# EAGLE schematic esp01 (EAGLE 7.2.0)
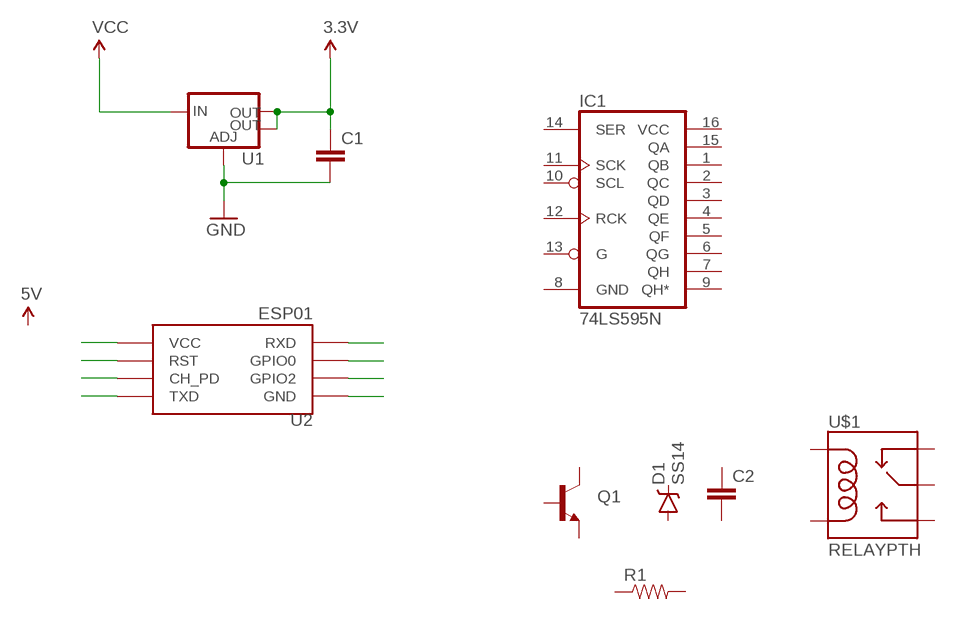
[diagram p0: schematic, sheet 1]

## Parts
C1  CAP0805  [0805]
C2  CAP0805  [0805]
D1  SS14  DIODE-SCHOTTKY-B340A  [SMA-DIODE]
IC1  74LS595N  [DIL16]
Q1  TRANSISTOR_NPNSOT23-3  [SOT23-3]
R1  RESISTOR0805-RES  [0805]
U1  V_REG_LM1117SOT223  [SOT223]
U2  ESP01  [ESP01]
U$1  RELAYPTH  [SRD-05VDC-SL-C]

## Nets
3.3V: C1.1 U1.2(OUT) U1.4(OUT) U2.VCC
CH_PD [io]: U2.CH_PD
GND: C1.2 U1.1(ADJ) U2.GND
GPIO0 [io]: U2.GPIO0
GPIO2 [io]: U2.GPIO2
RESET [io]: U2.RST
RX [io]: U2.RX(RXD)
TX [io]: U2.TX(TXD)
VCC: U1.3(IN)
Unconnected: C2.1 C2.2 D1.A D1.C IC1.1(QB) IC1.2(QC) IC1.3(QD) IC1.4(QE) IC1.5(QF) IC1.6(QG) IC1.7(QH) IC1.9(QH*) IC1.10(SCL) IC1.11(SCK) IC1.12(RCK) IC1.13(G) IC1.14(SER) IC1.15(QA) Q1.1(B) Q1.2(E) Q1.3(C) R1.1 R1.2 U$1.COIL0 U$1.COIL1 U$1.SWCLOSED(SWCLOSE) U$1.SWCOMMON U$1.SWOPEN

## Power pins joined to a net without a drawn wire
GND: IC1.8(GND)
VCC: IC1.16(VCC)

## Library data of the parts
C1 C2 = SparkFun-Capacitors:CAP: Capacitor Standard 0603 ceramic capacitor, and 0.1" leaded capacitor.
D1 = SparkFun-DiscreteSemi:DIODE-SCHOTTKY: Schottky diodes in SFE's production catalog BAT20J 1A 23V 0.62Vf RB751 120mA 40V 0.37Vf PMEG4005EJ 0.5A 40V 0.42Vf MBRA140 1A 40V 0.5Vf B340A 3A 40V SMA; PROD_ID: DIO-09886; VALUE: B340A
IC1 = SparkFun-DigitalIC:74*595: 8-bit SHIFT REGISTER, output latch
Q1 = SparkFun-DiscreteSemi:TRANSISTOR_NPN: Generic NPN BJT MMBT2222A - TRANS-08049 (SOT-23, 1A 40V) MPSA42 - TRANS-09116 (SOT-23, 500mA 300V) MMBT5088LT1G - TRANS-11160 (SOT-23, 50 mA 30V) BC547 - COM-08928 <http://www.sparkfun.com/products/8928> (TO-92 45V 100mA) (1.Collector 2.Base 3.Emitter) 2N3904 - COM-00521 <http://www.sparkfun.com/products/521> (TO-92 40V 200mA) (1.Emitter 2.Base 3.Collector) P2N2222A - COM-12852 <http://www.sparkfun.com/products/12852> (TO-92 40V 600mA) (1.Collector 2.Base 3.Emitter); PROD_ID: TRANS-08049
R1 = SparkFun-Resistors:RESISTOR: Resistor Basic schematic elements and footprints for 0603, 1206, and PTH resistors.
U1 = SparkFun-PowerIC:V_REG_LM1117: Voltage Regulator LM1117 Standard adjustable voltage regulator but in SMD form. Spark Fun Electronics SKU : COM-00595; PROD_ID: VREG-08170
U2 = esp8266modules:ESP01: ESP8266 Wifi module 01
U$1 = SRD-05VDC-SL-C:RELAY: SPDT relay (COM-00101)